# Altium schematic sheet Sheet1.SchDoc
size 142 x 208 mm; SheetNumber: 1; SheetTotal: 2
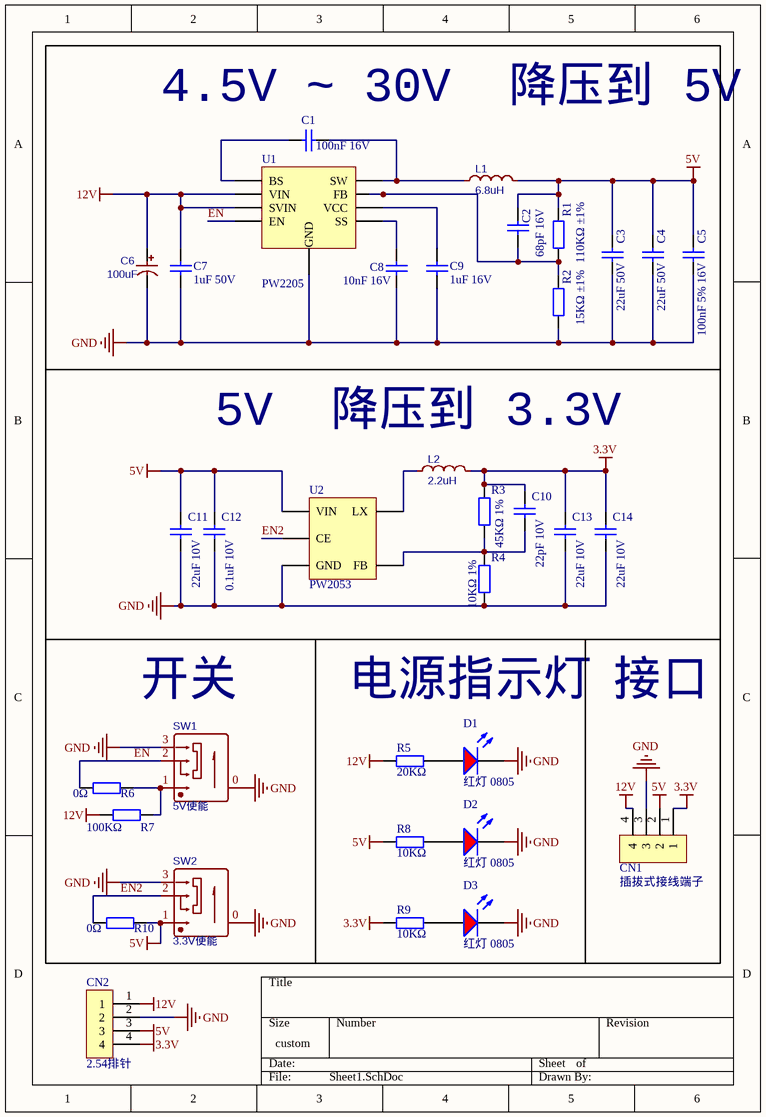
[diagram p0: Sheet1.SchDoc]

## Parts
C1  100nF 16V  [0805_C]
C2  68pF 16V  [0805_C]
C3  22uF 50V  [0805_C]
C4  22uF 50V  [0805_C]
C5  100nF 5% 16V  [0805_C]
C6  100uF  [电容 6.3*8]
C7  1uF 50V  [0805_C]
C8  10nF 16V  [0805_C]
C9  1uF 16V  [0805_C]
C10  22pF 10V  [0805_C]
C11  22uF 10V  [0805_C]
C12  0.1uF 10V  [0805_C]
C13  22uF 10V  [0805_C]
C14  22uF 10V  [0805_C]
CN1  插拔式接线端子  [插拔式接线端子-弯插]
CN2  2.54排针  [2.54排针]
D1  红灯 0805  [0805_LED_S1]
D2  红灯 0805  [0805_LED_S1]
D3  红灯 0805  [0805_LED_S1]
L1  6.8uH  [电感 0650]
L2  2.2uH  [电感 0520]
R1  110KΩ ±1%  [0805_R]
R2  15KΩ ±1%  [0805_R]
R3  45KΩ 1%  [0805_R]
R4  10KΩ 1%  [0805_R]
R5  20KΩ  [0805_R]
R6  0Ω  [0805_R]
R7  100KΩ  [0805_R]
R8  10KΩ  [0805_R]
R9  10KΩ  [0805_R]
R10  0Ω  [0805_R]
SW1  5V使能  [拨动开关(侧)]
SW2  3.3V使能  [拨动开关(侧)]
U1  PW2205  [PW2205 - SOP8]
U2  PW2053  [PW2053 - SOT23-6]

## Nets
3.3V: C10.2 C13.2 C14.2 CN1.1 CN2.4 L2.2 R3.2 R9.1
5V: C2.2 C3.2 C4.2 C5.2 C11.2 C12.2 CN1.2 CN2.3 L1.2 R1.2 R8.1 R10.2 SW2.1 U2.VIN
12V: C6.1 C7.2 CN1.4 CN2.1 R5.1 R7.1 U1.SVIN U1.VIN
GND: C3.1 C4.1 C5.1 C6.2 C7.1 C8.1 C9.1 C11.1 C12.1 C13.1 C14.1 CN1.3 CN2.2 D1.K D2.K D3.K R2.1 R4.1 SW1.0 SW1.3 SW2.0 SW2.3 U1.GND U2.GND
EN: R6.1 SW1.2 U1.EN
EN2: R10.1 SW2.2 U2.CE
NetC1_1: C1.1 U1.BS
NetC1_2: C1.2 L1.1 U1.SW
NetC2_1: C2.1 R1.1 R2.2 U1.FB
NetC8_2: C8.2 U1.SS
NetC9_2: C9.2 U1.VCC
NetC10_1: C10.1 R3.1 R4.2 U2.FB
NetD1_A: D1.A R5.2
NetD2_A: D2.A R8.2
NetD3_A: D3.A R9.2
NetL2_1: L2.1 U2.LX
NetR6_2: R6.2 R7.2 SW1.1

## Notes on the sheet
- (near C1) 4.5V ~ 30V  降压到 5V
- (near L2) 5V  降压到 3.3V
- (near SW1) 开关
- 电源指示灯
- 接口

## Library data of the parts
C1 C5 = 0805 100nF(104) 10% 50V: 贴片电容; ComponentLink1Description: 供应商链接; ComponentLink1URL: http://www.szlcsc.com/product/details_50686.html; Package: 0805; Supplier: LC; SuppliersPartNumber: C49678
C2 = 0805 68pF (680) 5% 50V: 贴片电容; ComponentLink1Description: 供应商链接; ComponentLink1URL: http://www.szlcsc.com/product/details_2186.html; Package: 0805; Supplier: LC; SuppliersPartNumber: C1834
C3 C4 C11 C13 C14 = 0805 22uF (226) 20% 25V: 贴片电容; ComponentLink1Description: 供应商链接; ComponentLink1URL: http://www.szlcsc.com/product/details_46786.html; Package: 0805; Supplier: LC; SuppliersPartNumber: C45783
C6 = 电容 6.3*8: BOM_Manufacturer: AISHI; BOM_Manufacturer Part: SPZ1VM101E08000R; nameAlias: Capacitance; BOM_Supplier: LCSC; BOM_Supplier Part: C122240; BOM_JLCPCB Part Class: Extended Part; spicePre: C; spiceSymbolName: SPZ1VM101E08000R
C7 C9 = 0805 1uF (105) 10% 50V: 贴片电容; ComponentLink1Description: 供应商链接; ComponentLink1URL: http://www.szlcsc.com/product/details_29074.html; Package: 0805; Supplier: LC; SuppliersPartNumber: C28323
C8 = 0805 10nF (103) 10% 50V: 贴片电容; ComponentLink1Description: 供应商链接; ComponentLink1URL: http://www.szlcsc.com/product/details_2062.html; Package: 0805; Supplier: LC; SuppliersPartNumber: C1710
C10 C12 = 0603 10pF (100) 5% 50V: 贴片电容; ComponentLink1Description: 供应商链接; ComponentLink1URL: http://www.szlcsc.com/product/details_1986.html; Package: 0603; Supplier: LC; SuppliersPartNumber: C1634
D1-D3 = 0805 红灯: 发光二极管; ComponentLink1Description: 供应商链接; ComponentLink1URL: http://www.szlcsc.com/product/details_2668.html; Package: 0805; Supplier: LC; SuppliersPartNumber: C2295
L1 L2 = 电感 6.8uH: BOM_Manufacturer: cjiang(Changjiang Microelectronics Tech); BOM_Manufacturer Part: FXL0650-6R8-M; nameAlias: Inductance; Contributor: LCSC; BOM_Supplier: LCSC; BOM_Supplier Part: C475530; spicePre: L; spiceSymbolName: FXL0650-6R8-M
R1 = 0805 110KΩ (1103) 1%: 贴片电阻; ComponentLink1Description: 供应商链接; ComponentLink1URL: http://www.szlcsc.com/product/details_18110.html; Package: 0805; Supplier: LC; SuppliersPartNumber: C17422
R2 = 0805 15KΩ (1502) 1%: 贴片电阻; ComponentLink1Description: 供应商链接; ComponentLink1URL: http://www.szlcsc.com/product/details_18163.html; Package: 0805; Supplier: LC; SuppliersPartNumber: C17475
R3 R4 = 0603 10KΩ (1002) 1%: 贴片电阻; ComponentLink1Description: 供应商链接; ComponentLink1URL: http://www.szlcsc.com/product/details_26547.html; Package: 0603; Supplier: LC; SuppliersPartNumber: C25804
R5 = 0805 4.7KΩ (4701) 1%: 贴片电阻; ComponentLink1Description: 供应商链接; ComponentLink1URL: http://www.szlcsc.com/product/details_18361.html; Package: 0805; Supplier: LC; SuppliersPartNumber: C17673
R6 R10 = 0805 0Ω (0R0) 1%: 贴片电阻; ComponentLink1Description: 供应商链接; ComponentLink1URL: http://www.szlcsc.com/product/details_18165.html; Package: 0805; Supplier: LC; SuppliersPartNumber: C17477
R7 = 0805 100KΩ (1003) 1%: 贴片电阻; ComponentLink1Description: 供应商链接; ComponentLink1URL: http://www.szlcsc.com/product/details_18095.html; Package: 0805; Supplier: LC; SuppliersPartNumber: C17407
R8 R9 = 0805 1KΩ (1001) 1%: 贴片电阻; ComponentLink1Description: 供应商链接; ComponentLink1URL: http://www.szlcsc.com/product/details_18201.html; Package: 0805; Supplier: LC; SuppliersPartNumber: C17513
SW1 SW2 = 拨动开关(侧): BOM_Manufacturer: XKB Enterprise; BOM_Manufacturer Part: SK-3296S-01-L1; Contributor: LCSC; BOM_Supplier: LCSC; BOM_Supplier Part: C319020; BOM_JLCPCB Part Class: Extended Part; spicePre: S; spiceSymbolName: SK-3296S-01-L1